# EAGLE design oldRPI_Levelshifter_LED_V02 (EAGLE 7.6.0)
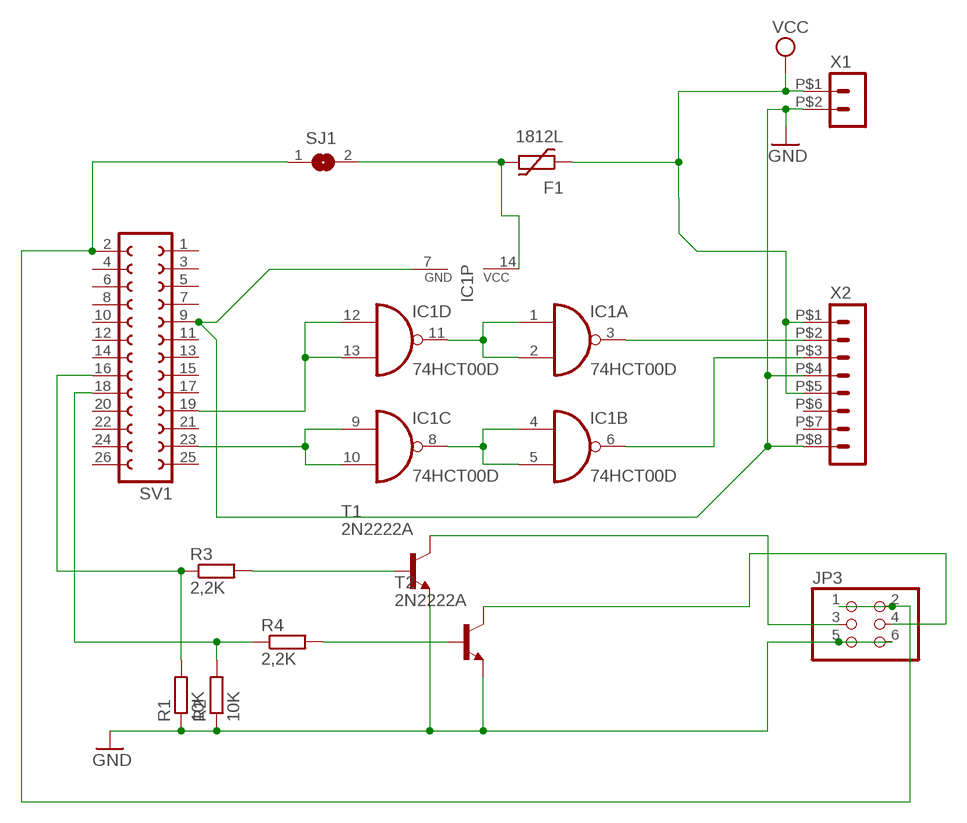
[diagram p0: schematic, sheet 1]

## Parts
F1  1812L  [1812L]
IC1  74HCT00D  [SO14]
JP3  PINHD-2X3/90  [2X03/90]
R1  10K  R-EU_R1206  [R1206]
R2  10K  R-EU_R1206  [R1206]
R3  2,2K  R-EU_R1206  [R1206]
R4  2,2K  R-EU_R1206  [R1206]
SJ1  SJ  [SJ]
SV1  FE13-2  [FE13-2]
T1  2N2222A  -NPN-SOT23-EBC  [SOT23-EBC]
T2  2N2222A  -NPN-SOT23-EBC  [SOT23-EBC]
X1  HEADER_POS2_43045-0200  [43045-0200]
X2  HEADER_POS8_43045-0800  [43045-0800]

## Nets
5V_RPI: JP3.1 JP3.2 SJ1.1 SV1.2
GND: IC1.7(P:GND) JP3.5 JP3.6 R1.1 R2.1 SV1.9 T1.E T2.E X1.P$2 X2.P$4 X2.P$8
N$1: IC1.1(A:I0) IC1.2(A:I1) IC1.11(D:O)
N$2: F1.P$2 IC1.14(P:VCC) SJ1.2
N$3: IC1.4(B:I0) IC1.5(B:I1) IC1.8(C:O)
N$4: IC1.3(A:O) X2.P$2
N$5: IC1.12(D:I0) IC1.13(D:I1) SV1.19
N$6: IC1.9(C:I0) IC1.10(C:I1) SV1.23
N$7: IC1.6(B:O) X2.P$3
N$9: R3.2 T1.B
N$10: R4.2 T2.B
N$11: JP3.3 T1.C
N$12: JP3.4 T2.C
N$13: R2.2 R4.1 SV1.18
N$14: R1.2 R3.1 SV1.16
VCC: F1.P$1 X1.P$1 X2.P$1 X2.P$5
Unconnected: SV1.1 SV1.3 SV1.4 SV1.5 SV1.6 SV1.7 SV1.8 SV1.10 SV1.11 SV1.12 SV1.13 SV1.14 SV1.15 SV1.17 SV1.20 SV1.21 SV1.22 SV1.24 SV1.25 SV1.26 X2.P$6 X2.P$7

## Library data of the parts
F1 = ptc-littlefuse:1812L
IC1 = 74xx-eu:74*00: Quad 2-input NAND gate
JP3 = pinhead:PINHD-2X3: PIN HEADER
R1-R4 = resistor:R-EU_: RESISTOR, European symbol
SJ1 = jumper:SJ: SMD solder JUMPER
SV1 = con-lsta:FE13-2: FEMALE HEADER; OC_FARNELL: unknown; OC_NEWARK: unknown
T1 T2 = transistor:*-NPN-: NPN Transistror BF959 corrected 2008.03.06
X1 = con-molex-micro-fit-3_0:HEADER_POS2_?: Molex - Micro-Fit 3.0 Series connector, 3.00mm (0.118") pitch header, 2 positions.
X2 = con-molex-micro-fit-3_0:HEADER_POS8_?: Molex - Micro-Fit 3.0 Series connector, 3.00mm (0.118") pitch header, 8 positions.

## Board
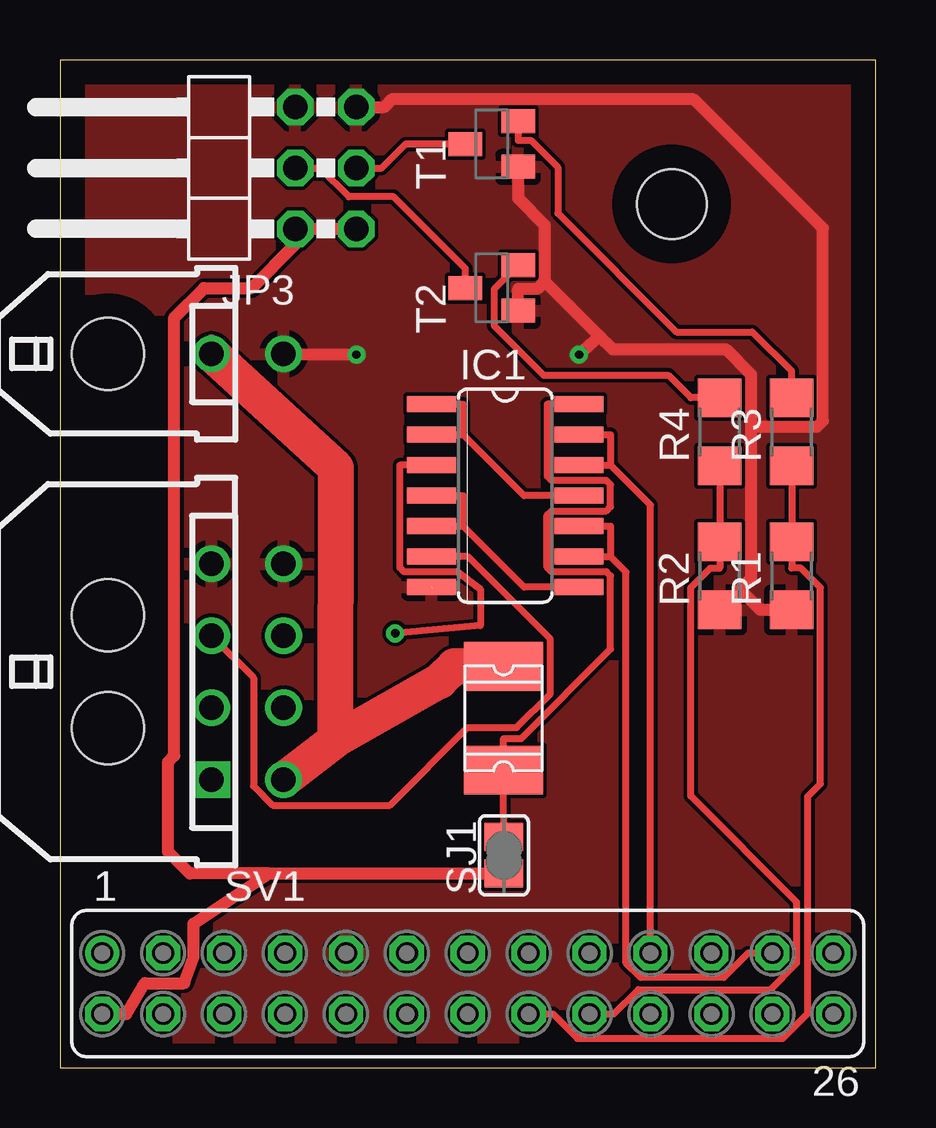
[diagram p1: board, top side]
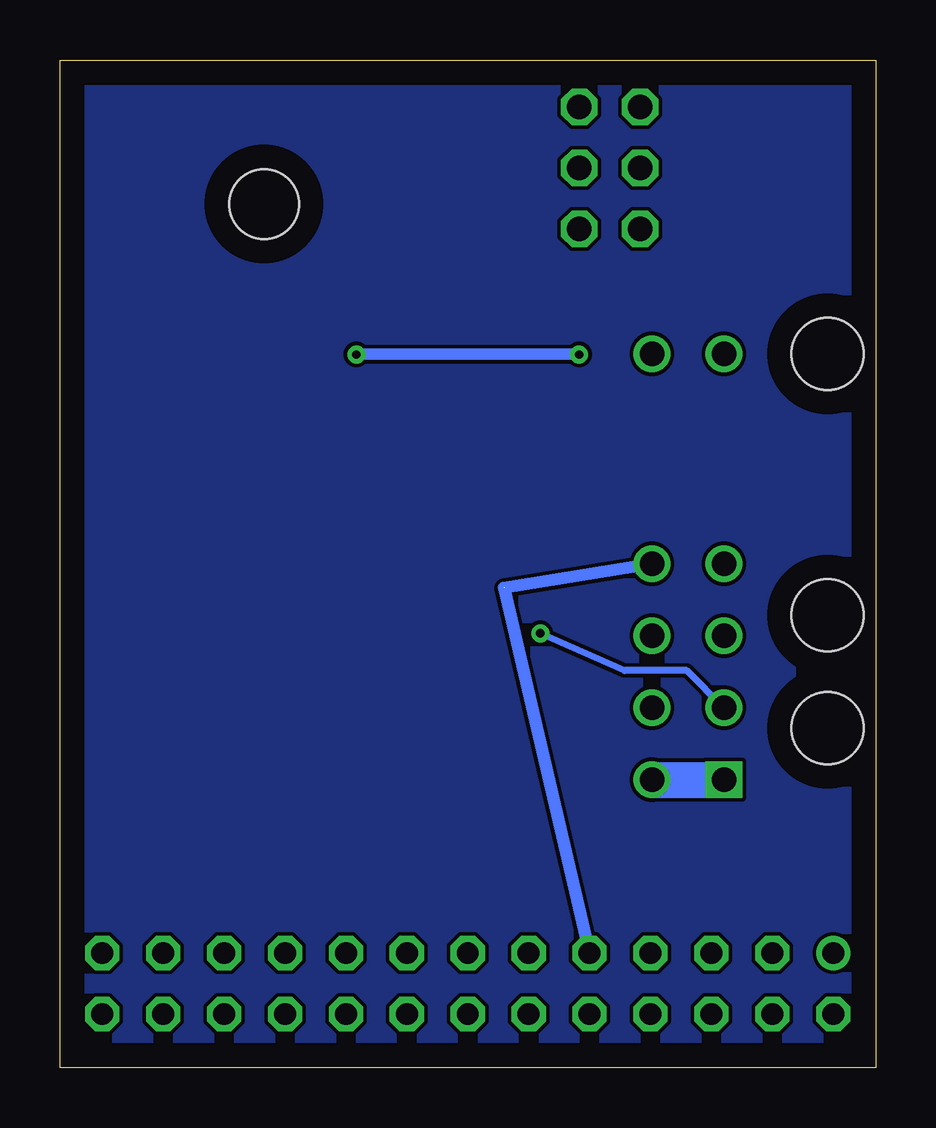
[diagram p2: board, bottom side, seen from below]

Size 34 x 42 mm. Coordinates in mm from the lower left corner, seen from the top.
Outline: 0,0 34,0 34,42 0,42 0,0
Copper layers (1*16): Top 0.035mm / dielectric 1.5mm / Bottom 0.035mm
Design rules "default": minimum track width 6mil, minimum drill 0.35mm, track to track 6mil, track to pad 6mil, pad to pad 6mil, via to via 6mil, smd to smd 6mil, copper to edge 40mil, drill to drill 6mil, minimum pad ring 10mil, minimum via ring 8mil, stop-mask expansion 4mil, vias tented up to drill 0mil, thermal gap 10mil
Holes 2.9 mm at 25.5,36

### Footprints (pad centres in the part's own frame; a part is rotated, then mirrored left to right if it is on the bottom)
1812L = smd 2.03 x 3.3: P$1 -2.16,0; P$2 2.16,0
SO14 = smd 0.66 x 2.032: 1 -3.81,-3.073; 2 -2.54,-3.073; 3 -1.27,-3.073; 4 0,-3.073; 5 1.27,-3.073; 6 2.54,-3.073; 7 3.81,-3.073; 8 3.81,3.073; 9 2.54,3.073; 10 1.27,3.073; 11 0,3.073; 12 -1.27,3.073; 13 -2.54,3.073; 14 -3.81,3.073
2X03/90 = drill 1.016 octagon: 1 -2.54,-6.35; 2 -2.54,-3.81; 3 0,-6.35; 4 0,-3.81; 5 2.54,-6.35; 6 2.54,-3.81
R1206 = smd 1.6 x 1.803: 1 -1.422,0; 2 1.422,0
SJ = smd 1.168 x 1.6: 1 -0.762,0; 2 0.762,0
FE13-2 = drill 0.914: 1 -15.24,1.27 | drill 0.914 octagon: 2 -15.24,-1.27; 3 -12.7,1.27; 4 -12.7,-1.27; 5 -10.16,1.27; 6 -10.16,-1.27; 7 -7.62,1.27; 8 -7.62,-1.27; 9 -5.08,1.27; 10 -5.08,-1.27; 11 -2.54,1.27; 12 -2.54,-1.27; 13 0,1.27; 14 0,-1.27; 15 2.54,1.27; 16 2.54,-1.27; 17 5.08,1.27; 18 5.08,-1.27; 19 7.62,1.27; 20 7.62,-1.27; 21 10.16,1.27; 22 10.16,-1.27; 23 12.7,1.27; 24 12.7,-1.27; 25 15.24,1.27; 26 15.24,-1.27
SOT23-EBC = smd 1 x 1.4: B 0.95,-1.1; C 0,1.1; E -0.95,-1.1
43045-0200 = drill 1.02: P$1 0,4.32; P$2 0,7.32 | hole 3: 0,0
43045-0800 = drill 1.02 square: P$1 4.5,4.32 | drill 1.02: P$2 1.5,4.32; P$3 -1.5,4.32; P$4 -4.5,4.32; P$5 4.5,7.32; P$6 1.5,7.32; P$7 -1.5,7.32; P$8 -4.5,7.32 | hole 3: 2.35,0; -2.35,0

### Placement (x,y rotation side)
F1  18.49,14.56 270 top
IC1  18.56,23.84 270 top
JP3  6,37.5 90 top
R1  30.5,20.5 90 top
R2  27.5,20.5 90 top
R3  30.5,26.5 90 top
R4  27.5,26.5 90 top
SJ1  18.51,8.85 90 top
SV1  17,3.5 0 top
T1  18,38.5 90 top
T2  18,32.5 90 top
X1  2,29.75 270 top
X2  2,16.5 270 top

### Tracks (layer width: path | path; a pad name or v marks a point on that pad's centre or on a via)
5V_RPI
  Top 0.5: SV1.2 2.77,2.23 3.53,3.52 5.18,3.52 5.57,4.6 5.57,6 8.72,8.09 | 8.72,8.09 SJ1.1 | 8.72,8.09 5.41,8.09 4.5,9 4.5,12.74 4.77,13 4.77,31.27 6,32.5 8,32.5 9.81,34.31 JP3.2 JP3.1
GND  (via drill 0.35 pad 0.76)  (1 unrouted)
  Top 0.5: 28.8,26.72 28.8,20.38 28.35,19.93 | 20.21,32.78 21.25,31.75 22.5,30.5 | 22.5,30.5 23.05,29.94 27.76,29.94 28.8,28.89 28.8,26.72 | 28.8,26.72 31.57,26.72 31.8,26.95 31.8,34.98 26.43,40.36 13.83,40.36 13.51,40.04 JP3.5 | 28.35,19.93 R2.1 | 28.35,19.93 29.2,19.08 R1.1 | 20.21,32.78 20.21,35.12 19.1,36.23 19.1,36.65 T1.E | 20.21,32.78 19.88,32.45 19.1,32.45 T2.E | X1.P$2 v12.36,29.72 | v21.64,29.72 22.5,30.5
  Bottom 0.5: X2.P$8 15.5,20 SV1.9 | v12.36,29.72 21.57,29.74 v21.64,29.72
  pour Top: 0.5,0.5 0.5,41.5 33.5,41.5 33.5,0.5
N$1
  Top 0.3: IC1.11 19.34,23.84 16.8,26.38 | 16.8,26.38 16.8,27.65 IC1.1 | IC1.2 16.8,26.38
N$2
  Top 0.3: IC1.14 20.32,27.65 20.32,24.65 20.49,24.47 22.78,24.47 22.95,24.3 22.95,23.38 22.77,23.2 20.49,23.2 20.31,23.02 20.31,20.85 20.5,20.66 22.78,20.66 22.95,20.49 22.95,17.44 19.23,13.72 18.49,13.72 F1.P$2 18.49,10.51 18.51,10.5 SJ1.2
N$3
  Top 0.3: IC1.8 19.34,20.03 16.8,22.57 | 16.8,22.57 16.8,23.84 IC1.4 | IC1.5 16.8,22.57
N$4  (via drill 0.35 pad 0.76)
  Top 0.3: IC1.3 14.17,25.11 14.17,20.84 14.35,20.66 16.58,20.66 17.52,19.94 17.52,18.42 v13.97,18.1
  Bottom 0.3: X2.P$2 7.87,16.55 10.46,16.55 v13.97,18.1
N$5
  Top 0.3: SV1.19 24.62,23.44 22.95,25.11 | IC1.13 22.95,26.38 22.95,25.11 | IC1.12 22.95,25.11
N$6
  Top 0.3: SV1.23 28.69,4.77 27.67,3.75 24.2,3.75 23.6,4.35 23.6,20.65 22.95,21.3 | IC1.10 22.95,22.57 22.95,21.3 | IC1.9 22.95,21.3
N$7
  Top 0.3: X2.P$3 8.07,16.25 8.07,11.74 8.87,10.93 13.75,10.93 16.99,14.17 19.04,14.17 20.44,15.58 20.44,17.86 17,21.3 IC1.6
N$9
  Top 0.3: R3.2 30.5,29.02 28.86,30.66 25.7,30.66 20.75,35.6 20.75,37.52 19.63,38.65 19.1,38.65 T1.B
N$10
  Top 0.3: R4.2 26.3,27.92 25.36,28.86 20.16,28.86 18.1,30.92 18.1,32.45 T2.B
N$11
  Top 0.3: JP3.3 13.41,37.5 14.41,38.5 T1.C
N$12
  Top 0.3: JP3.4 10.87,37.5 10.87,37.47 12.05,36.29 13.91,36.29 16.9,33.3 T2.C
N$13
  Top 0.3: SV1.18 23.09,2.23 24.11,3.24 29.61,3.24 30.72,4.35 30.72,6.89 26.3,11.31 26.3,20 27.11,20.82 27.5,20.82 R2.2 R4.1
N$14
  Top 0.3: SV1.16 20.55,2.23 21.57,1.22 30.13,1.22 31.17,2.26 31.17,11.29 31.7,11.82 31.7,20 30.89,20.82 30.5,20.82 R1.2 R3.1
N$15
  pour Bottom: 0.5,0.5 0.5,41.5 33.5,41.5 33.5,0.5
VCC
  Top 0.5: X1.P$1 6.32,30.31
  Top 1.5: X2.P$5 11.48,13.66 | F1.P$1 16.44,16.72 15.83,16.11 11.48,13.66 | 11.48,13.66 11.51,25 X1.P$1
  Bottom 1.5: X2.P$5 X2.P$1